# Altium schematic sheet Power.SchDoc
size A4; SheetNumber: 3; SheetTotal: 3
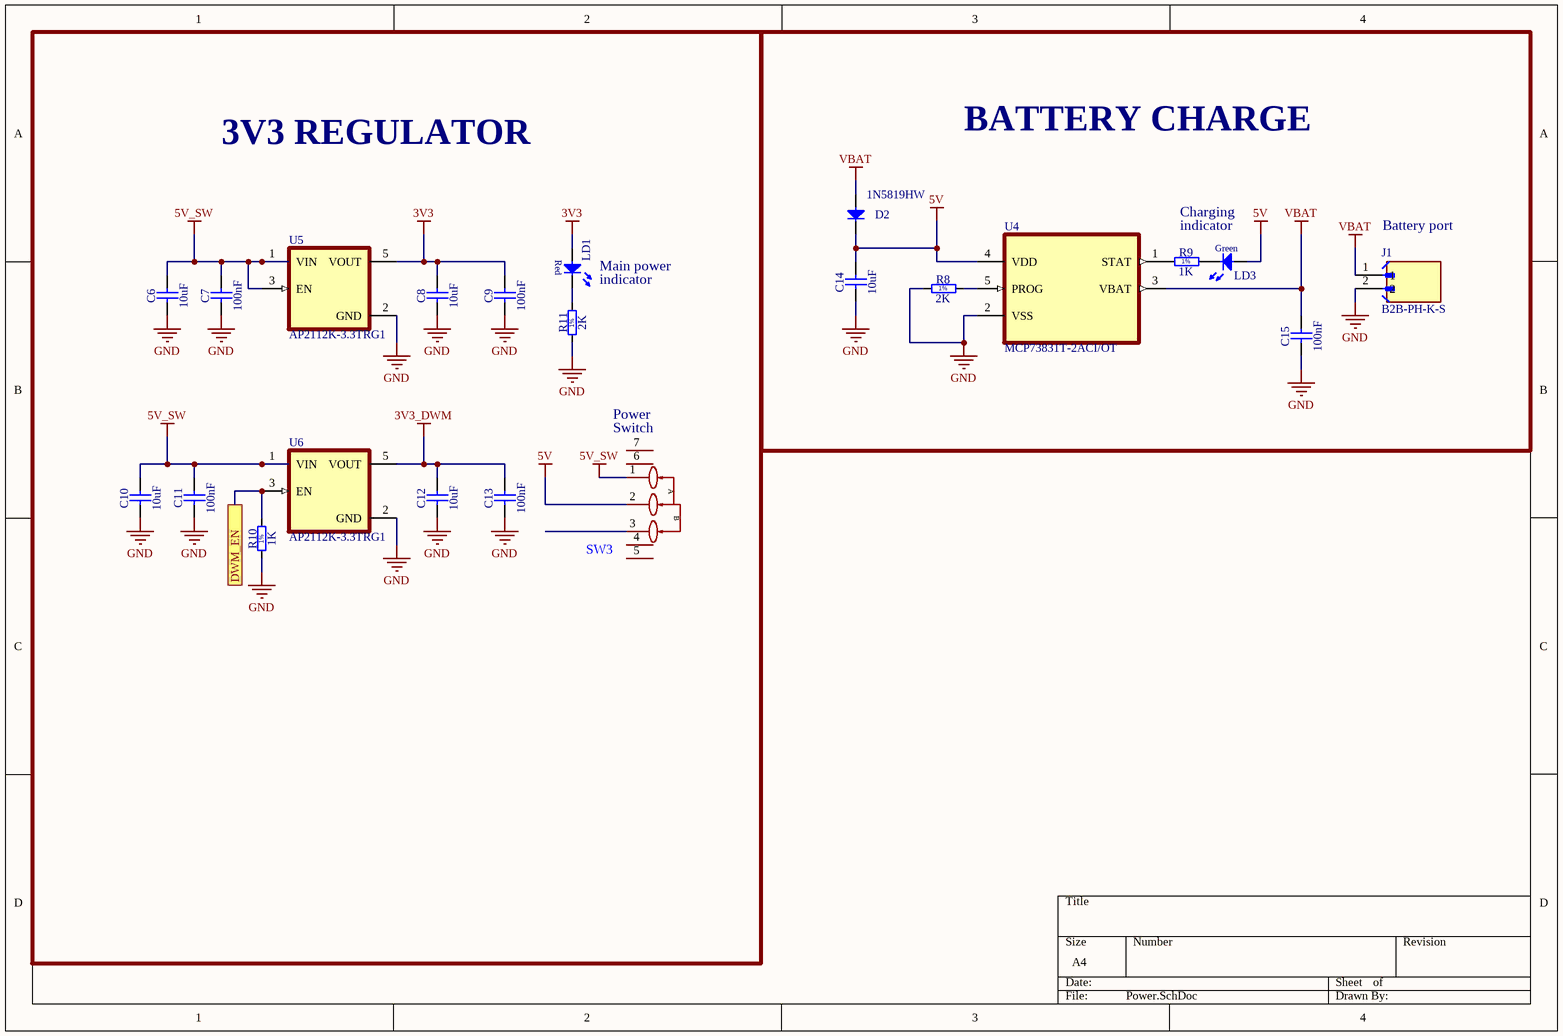
[diagram p0: Power.SchDoc]

## Parts
C6  10uF  [0603C]
C7  100nF  [0603C]
C8  10uF  [0603C]
C9  100nF  [0603C]
C10  10uF  [0603C]
C11  100nF  [0603C]
C12  10uF  [0603C]
C13  100nF  [0603C]
C14  10uF  [0603C]
C15  100nF  [0603C]
D2  1N5819HW  [SOD-123FL]
J1  B2B-PH-K-S  [JST_B2B-PH-K-S]
LD1  (no value)  [0603 LED]
LD3  GREEN  [0603 LED]  (value not drawn)
R8  2K  [0603R]
R9  1K  [0603R]
R10  1K  [0603R]
R11  2K  [0603R]
SW3  MK-12C02-G020  [SW-SMD_MK-12C02-G020]  (value not drawn)
U4  MCP73831T-2ACI/OT  [SOT95P280X145-5N]
U5  AP2112K-3.3TRG1  [SOT95P285X140-5N]
U6  AP2112K-3.3TRG1  [SOT95P285X140-5N]

## Blocks framed on the sheet
3V3 REGULATOR: C6-C13 LD1 R10 R11 SW3 U5 U6
BATTERY CHARGE: C14 C15 D2 J1 LD3 R8 R9 U4

## Ports
DWM_EN

## Nets
3V3: C8.2 C9.2 LD1.2(A) U5.5(VOUT)
3V3_DWM: C12.2 C13.2 U6.5(VOUT)
5V: C14.2 D2.1(C) LD3.2(A) SW3.2 U4.4(VDD)
5V_SW: C6.2 C7.2 C10.2 C11.2 SW3.1 U5.1(VIN) U5.3(EN) U6.1(VIN)
GND: C6.1 C7.1 C8.1 C9.1 C10.1 C11.1 C12.1 C13.1 C14.1 C15.1 J1.2 R8.1 R10.1 R11.1 U4.2(VSS) U5.2(GND) U6.2(GND)
VBAT: C15.2 D2.2(A) J1.1 U4.3(VBAT)
DWM_EN: R10.2 U6.3(EN) ; port DWM_EN
NetLD1_1: LD1.1(C) R11.2
NetLD3_1: LD3.1(C) R9.2
NetR8_2: R8.2 U4.5(PROG)
NetR9_1: R9.1 U4.1(STAT)

Not connected (* = marked no-connect by the designer): SW3 3 4 5 6 7

## Notes on the sheet
- Charging
- indicator
- (near J1) Battery port
- Main power
- (near SW3) Switch
- (near SW3) Power
- (in symbol LED Green 1C 2A) Green
- (in symbol LED Red 1C 2A) Red
- (in symbol MK-12C02-G020) A; B
- (in symbol Resistor - 1%_1) 1%

## Library data of the parts
C6-C15 = Capacitor - non polarized: Non-polarised capacitor
D2 = Diode A1C3: Diode Anode Pin 1 Cathode Pin 3 (Pas de pin 2)
J1 = B2B-PH-K-S: Connector Header Through Hole 2 position 0.079 (2.00mm); MF: JST Sales America Inc.; SnapEDA_Link: https://www.snapeda.com/parts/B2B-PH-K-S/JST/view-part/?ref=snap; Package: None; Value: *; MP: B2B-PH-K-S; Check_prices: https://www.snapeda.com/parts/B2B-PH-K-S/JST/view-part/?ref=eda
LD1 = LED Red 1C 2A
LD3 = LED Green 1C 2A
R8-R11 = Resistor - 1%_1: Resistor - 1%
SW3 = MK-12C02-G020: Manufacturer: G-Switch(品赞); Add into BOM: yes; Circuit: SPDT; Actuator Style: Rectangular Columnar; Switch Height: 4.7mm; Actuator Color: Black; Current Rating: 1A; Voltage Rating: 6V; Life: 10,000 Cycles; Symbol: MK-12C02-G020; Device: MK-12C02-G020; LCSC Part Name: 微型拨动开关; Supplier Part: C963206; Manufacturer Part: MK-12C02-G020; Supplier Footprint: SMD,6.6x1.4mm; JLCPCB Part Class: Extended Part; Datasheet: https://item.szlcsc.com/datasheet/MK-12C02-G020/1046841.html; Supplier: LCSC; Convert to PCB: yes; Termination Style: -; Length: 6.6mm; Width: 1.4mm; Mounting Type: Surface Mount, Right Angle; Operating Temperature: -20℃~+70℃
U4 = MCP73831T-2ACI/OT: Charger IC Lithium Ion/Polymer SOT-23-5; MF: Microchip; Package: SOT-23 Microchip; Purchase-URL: https://pricing.snapeda.com/search/part/MCP73831T-2ACI/OT/?ref=eda; MP: MCP73831T-2ACI/OT; Value: *; Availability: In Stock; SnapEDA_Link: https://www.snapeda.com/parts/MCP73831T-2ACI/OT/Microchip/view-part/?ref=snap; Price: None; Check_prices: https://www.snapeda.com/parts/MCP73831T-2ACI/OT/Microchip/view-part/?ref=eda
U5 U6 = AP2112K-3.3TRG1: Linear Voltage Regulator IC Positive Fixed 1 Output 600mA SOT-25; MF: Diodes Inc.; Value: *; Purchase-URL: https://pricing.snapeda.com/search/part/AP2112K-3.3TRG1/?ref=eda; Package: SOT-753 Diodes Inc.; Availability: In Stock; Check_prices: https://www.snapeda.com/parts/AP2112K-3.3TRG1/Diodes+Inc./view-part/?ref=eda; Price: None; SnapEDA_Link: https://www.snapeda.com/parts/AP2112K-3.3TRG1/Diodes+Inc./view-part/?ref=snap; MP: AP2112K-3.3TRG1